# Altium schematic sheet TP2.SchDoc
size A; PageSetup: Record=PageOptions|CenterHorizontal=True|CenterVertical=True|PrintScale=1.00|XCorrection=1.00|YCorrection=1.00|PrintKind=0|BorderSize=5000000|LeftOffset=0|BottomOffset=0|Orientation=2|PaperLength=1000|PaperWidth=1000|Scale=100|PaperSource=7|PrintQuality=-3|MediaType=1|DitherType=10|PrintScaleMode=1|PaperKind=Letter|PaperIndex=1
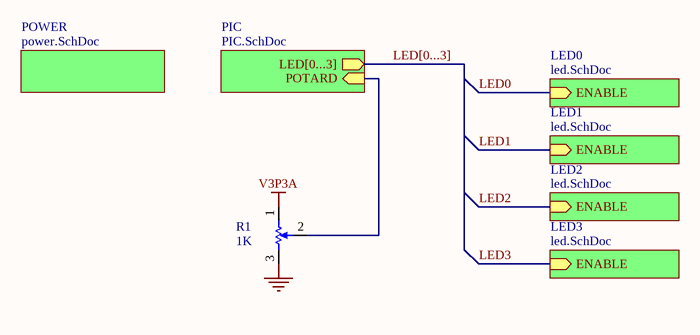
[diagram p0: TP2.SchDoc]

## Parts
R1  1K  [POT4MM-2]

## Sub-sheets
LED0 = led.SchDoc: ENABLE
LED1 = led.SchDoc: ENABLE
LED2 = led.SchDoc: ENABLE
LED3 = led.SchDoc: ENABLE
PIC = PIC.SchDoc: LED[0...3], POTARD
POWER = power.SchDoc: no entries

## Nets
V3P3A: R1.1(+)
VCC: R1.3(-)
LED0: sheet LED0/ENABLE
LED1: sheet LED1/ENABLE
LED2: sheet LED2/ENABLE
LED3: sheet LED3/ENABLE
NetR1_2: R1.2(W) ; sheet PIC/POTARD

## Buses and harness runs
bus LED[0...3] = sheet PIC/LED[0...3]

## Library data of the parts
R1 = RPot SM: Square Trimming Potentiometer; Published: 17-Dec-2003; DatasheetVersion: Oct-2003; PackageReference: POT4MM-2; Publisher: Altium Limited; PackageDescription: Square Trimming Potentiometer; ComponentLink1Description: Manufacturer Link; ComponentLink1URL: http://bourns.com/2/search.html